# EAGLE design NumPad (EAGLE 6.4)
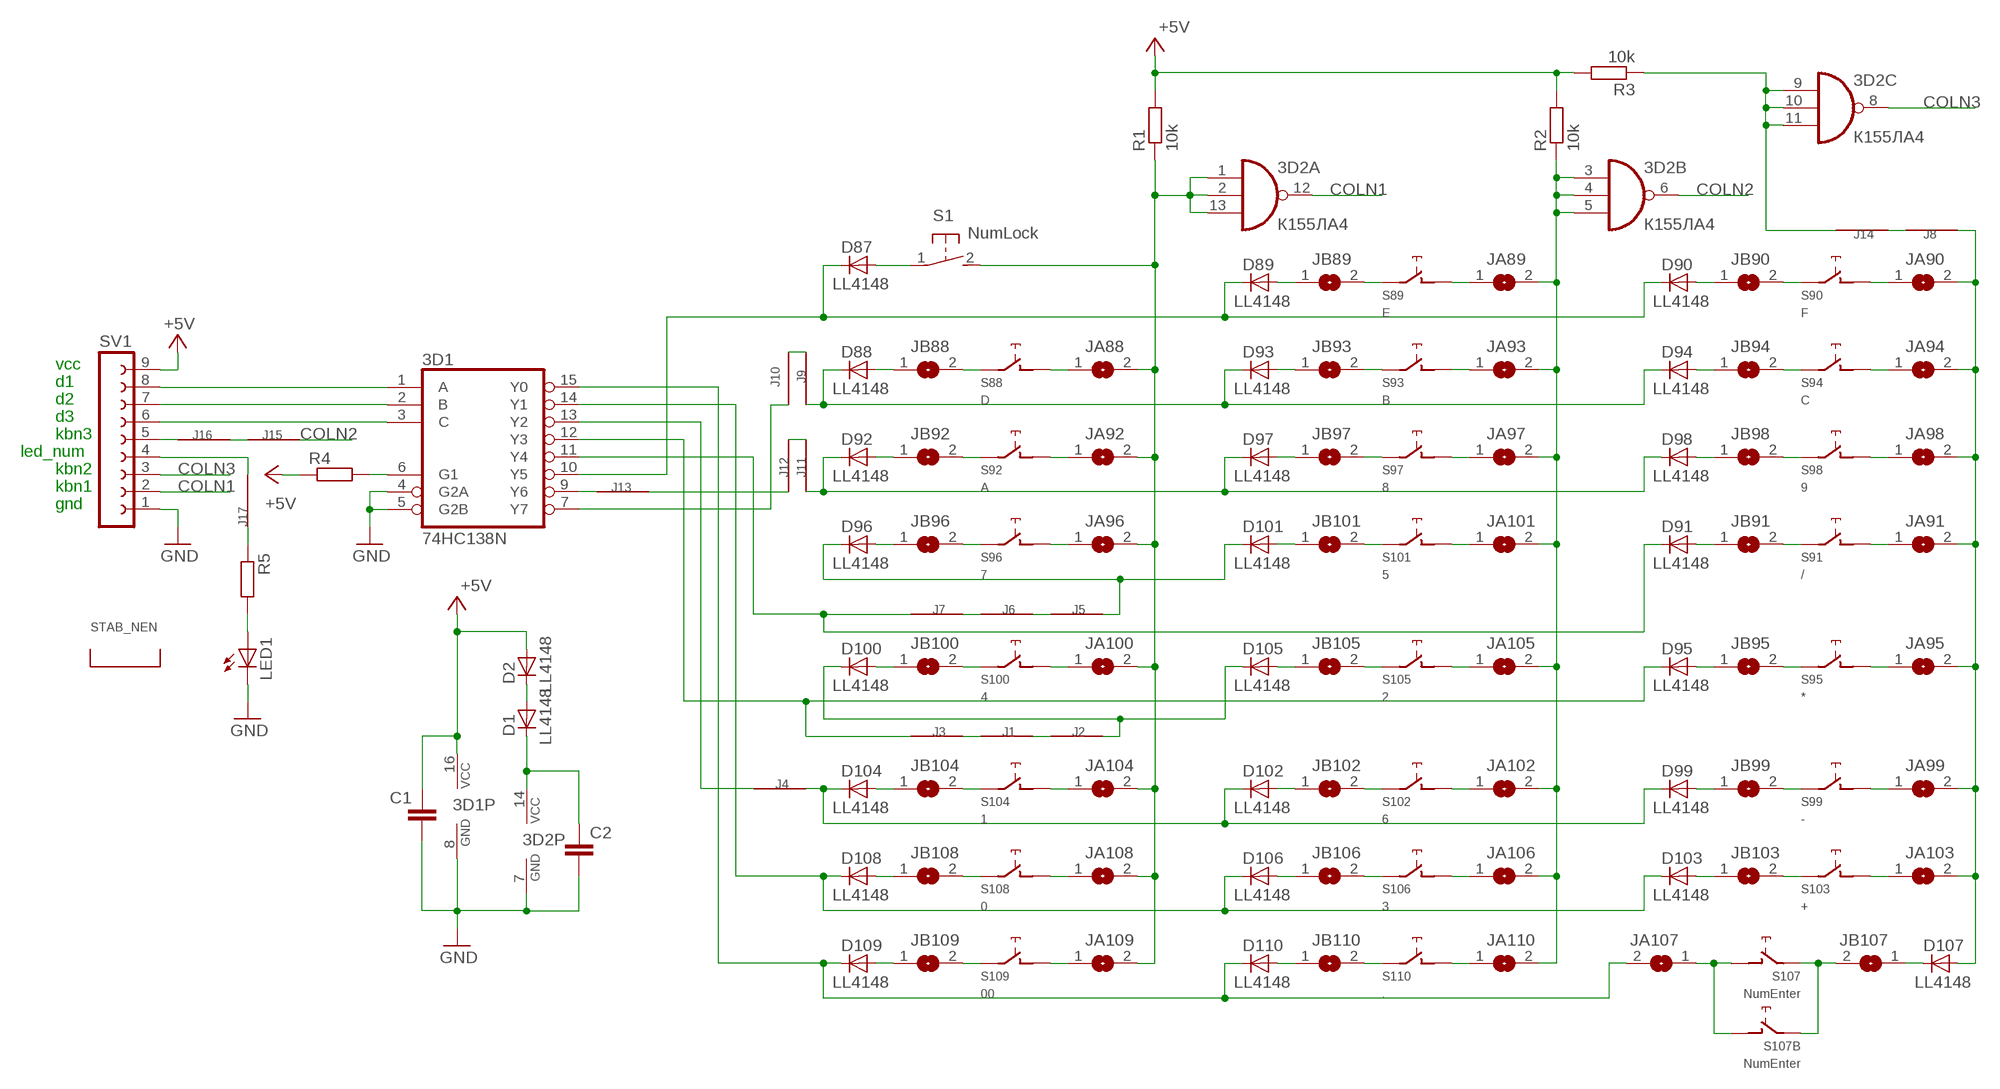
[diagram p0: schematic, sheet 1]

## Parts
3D1  74HC138N  [DIL16]
3D2  К155ЛА4  74HC10N  [DIL14]
C1  C-EUC1206  [C1206]
C2  C-EUC1206  [C1206]
D1  LL4148  [SOD80C]
D2  LL4148  [SOD80C]
D87  LL4148  [SOD80C]
D88  LL4148  [SOD80C]
D89  LL4148  [SOD80C]
D90  LL4148  [SOD80C]
D91  LL4148  [SOD80C]
D92  LL4148  [SOD80C]
D93  LL4148  [SOD80C]
D94  LL4148  [SOD80C]
D95  LL4148  [SOD80C]
D96  LL4148  [SOD80C]
D97  LL4148  [SOD80C]
D98  LL4148  [SOD80C]
D99  LL4148  [SOD80C]
D100  LL4148  [SOD80C]
D101  LL4148  [SOD80C]
D102  LL4148  [SOD80C]
D103  LL4148  [SOD80C]
D104  LL4148  [SOD80C]
D105  LL4148  [SOD80C]
D106  LL4148  [SOD80C]
D107  LL4148  [SOD80C]
D108  LL4148  [SOD80C]
D109  LL4148  [SOD80C]
D110  LL4148  [SOD80C]
J1  J  [R1206W]
J2  J  [R1206W]
J3  J  [R1206W]
J4  J  [R1206W]
J5  J  [R1206W]
J6  J  [R1206W]
J7  J  [R1206W]
J8  J  [R1206W]
J9  J  [R1206W]
J10  J  [R1206W]
J11  J  [R1206W]
J12  J  [R1206W]
J13  J  [R1206W]
J14  J  [R1206W]
J15  J  [R1206W]
J16  J  [R1206W]
J17  J  [R1206W]
JA88  SJ  [SJ]
JA89  SJ  [SJ]
JA90  SJ  [SJ]
JA91  SJ  [SJ]
JA92  SJ  [SJ]
JA93  SJ  [SJ]
JA94  SJ  [SJ]
JA95  SJ  [SJ]
JA96  SJ  [SJ]
JA97  SJ  [SJ]
JA98  SJ  [SJ]
JA99  SJ  [SJ]
JA100  SJ  [SJ]
JA101  SJ  [SJ]
JA102  SJ  [SJ]
JA103  SJ  [SJ]
JA104  SJ  [SJ]
JA105  SJ  [SJ]
JA106  SJ  [SJ]
JA107  SJ  [SJ]
JA108  SJ  [SJ]
JA109  SJ  [SJ]
JA110  SJ  [SJ]
JB88  SJ  [SJ]
JB89  SJ  [SJ]
JB90  SJ  [SJ]
JB91  SJ  [SJ]
JB92  SJ  [SJ]
JB93  SJ  [SJ]
JB94  SJ  [SJ]
JB95  SJ  [SJ]
JB96  SJ  [SJ]
JB97  SJ  [SJ]
JB98  SJ  [SJ]
JB99  SJ  [SJ]
JB100  SJ  [SJ]
JB101  SJ  [SJ]
JB102  SJ  [SJ]
JB103  SJ  [SJ]
JB104  SJ  [SJ]
JB105  SJ  [SJ]
JB106  SJ  [SJ]
JB107  SJ  [SJ]
JB108  SJ  [SJ]
JB109  SJ  [SJ]
JB110  SJ  [SJ]
LED1  LED5MM  [LED5MM]
R1  10k  R-EU_R1206W  [R1206W]
R2  10k  R-EU_R1206W  [R1206W]
R3  10k  R-EU_R1206W  [R1206W]
R4  R-EU_R1206W  [R1206W]
R5  R-EU_R1206W  [R1206W]
S1  NumLock  31-XX  [B3F-31XX]
S88  D  CHERRY-MX-4P  [CHERRY-MX-4P]
S89  E  CHERRY-MX-4P  [CHERRY-MX-4P]
S90  F  CHERRY-MX-4P  [CHERRY-MX-4P]
S91  /  CHERRY-MX-4P  [CHERRY-MX-4P]
S92  A  CHERRY-MX-4P  [CHERRY-MX-4P]
S93  B  CHERRY-MX-4P  [CHERRY-MX-4P]
S94  C  CHERRY-MX-4P  [CHERRY-MX-4P]
S95  *  CHERRY-MX-4P  [CHERRY-MX-4P]
S96  7  CHERRY-MX-4P  [CHERRY-MX-4P]
S97  8  CHERRY-MX-4P  [CHERRY-MX-4P]
S98  9  CHERRY-MX-4P  [CHERRY-MX-4P]
S99  -  CHERRY-MX-4P  [CHERRY-MX-4P]
S100  4  CHERRY-MX-4P  [CHERRY-MX-4P]
S101  5  CHERRY-MX-4P  [CHERRY-MX-4P]
S102  6  CHERRY-MX-4P  [CHERRY-MX-4P]
S103  +  CHERRY-MX-4P  [CHERRY-MX-4P]
S104  1  CHERRY-MX-4P  [CHERRY-MX-4P]
S105  2  CHERRY-MX-4P  [CHERRY-MX-4P]
S106  3  CHERRY-MX-4P  [CHERRY-MX-4P]
S107  NumEnter  CHERRY-MX-4P  [CHERRY-MX-4P]
S107B  NumEnter  CHERRY-MX-4P  [CHERRY-MX-4P]
S108  0  CHERRY-MX-4P  [CHERRY-MX-4P]
S109  00  CHERRY-MX-4P  [CHERRY-MX-4P]
S110  .  CHERRY-MX-4P  [CHERRY-MX-4P]
STAB_NEN  STAB  [ZEALIOS-PCB_2U]
SV1  FE09-1  [FE09]

## Nets
+5V: 3D1.16(VCC) C1.1 D2.A R1.2 R2.2 R3.2 R4.1 SV1.9
COLN1: 3D2.12(A:O) SV1.2
COLN2: 3D2.6(B:O) J15.1
COLN3: 3D2.8(C:O) SV1.3
GND: 3D1.4(G2A) 3D1.5(G2B) 3D1.8(GND) 3D2.7(P:GND) C1.2 C2.2 LED1.K(C) SV1.1
N$1: D92.C D97.C D98.C J11.2
N$2: D100.C D105.C J2.1
N$3: D107.C JB107.1
N$4: J1.2 J3.1
N$5: J1.1 J2.2
N$6: 3D1.1(A) SV1.8
N$7: 3D2.3(B:I0) 3D2.4(B:I1) 3D2.5(B:I2) JA89.2 JA93.2 JA97.2 JA101.2 JA102.2 JA105.2 JA106.2 JA110.2 R2.1
N$8: 3D1.2(B) SV1.7
N$9: D99.C D102.C D104.C J4.1
N$10: 3D1.3(C) SV1.6
N$11: 3D1.13(Y2) J4.2
N$12: D96.C D101.C J5.1
N$13: J6.2 J7.1
N$14: 3D2.1(A:I0) 3D2.2(A:I1) 3D2.13(A:I2) JA88.2 JA92.2 JA96.2 JA100.2 JA104.2 JA108.2 JA109.2 R1.1 S1.2(S)
N$15: J5.2 J6.1
N$16: D88.C D93.C D94.C J9.2
N$17: 3D2.9(C:I0) 3D2.10(C:I1) 3D2.11(C:I2) J14.1 R3.1
N$18: 3D1.7(Y7) J10.1
N$19: J9.1 J10.2
N$20: J11.1 J12.1
N$21: J12.2 J13.1
N$22: D107.A J8.2 JA90.2 JA91.2 JA94.2 JA95.2 JA98.2 JA99.2 JA103.2
N$23: 3D1.9(Y6) J13.2
N$24: 3D1.6(G1) R4.2
N$26: J8.1 J14.2
N$27: LED1.A R5.2
N$28: J16.2 SV1.5
N$29: J15.2 J16.1
N$30: J17.2 SV1.4
N$31: J17.1 R5.1
N$33: 3D1.10(Y5) D87.C D89.C D90.C
N$34: 3D1.11(Y4) D91.C J7.2
N$35: 3D1.12(Y3) D95.C J3.2
N$36: 3D1.14(Y1) D103.C D106.C D108.C
N$38: D1.A D2.C
N$39: 3D2.14(P:VCC) C2.1 D1.C
N$51: JA107.1 S107.SW2(PIN-2) S107B.SW2(PIN-2)
N$60: D104.A JB104.1
N$268: D87.A S1.1(P)
N$269: D88.A JB88.1
N$271: JB88.2 S88.SW1(PIN-1)
N$273: JA88.1 S88.SW2(PIN-2)
N$274: D89.A JB89.1
N$275: JB89.2 S89.SW1(PIN-1)
N$276: JA89.1 S89.SW2(PIN-2)
N$277: D90.A JB90.1
N$278: JB90.2 S90.SW1(PIN-1)
N$279: JA90.1 S90.SW2(PIN-2)
N$280: D91.A JB91.1
N$281: JB91.2 S91.SW1(PIN-1)
N$282: JA91.1 S91.SW2(PIN-2)
N$283: JB92.2 S92.SW1(PIN-1)
N$284: D92.A JB92.1
N$285: JA92.1 S92.SW2(PIN-2)
N$286: JA93.1 S93.SW2(PIN-2)
N$287: JB93.2 S93.SW1(PIN-1)
N$288: D93.A JB93.1
N$289: D94.A JB94.1
N$290: JB94.2 S94.SW1(PIN-1)
N$291: JA94.1 S94.SW2(PIN-2)
N$292: D95.A JB95.1
N$293: JB95.2 S95.SW1(PIN-1)
N$294: JA95.1 S95.SW2(PIN-2)
N$295: D96.A JB96.1
N$296: JB96.2 S96.SW1(PIN-1)
N$297: JA96.1 S96.SW2(PIN-2)
N$298: JB97.2 S97.SW1(PIN-1)
N$299: JA97.1 S97.SW2(PIN-2)
N$300: D97.A JB97.1
N$301: D98.A JB98.1
N$302: JB98.2 S98.SW1(PIN-1)
N$303: JA98.1 S98.SW2(PIN-2)
N$304: D99.A JB99.1
N$305: JB99.2 S99.SW1(PIN-1)
N$306: JA99.1 S99.SW2(PIN-2)
N$307: D100.A JB100.1
N$308: JB100.2 S100.SW1(PIN-1)
N$309: JA100.1 S100.SW2(PIN-2)
N$310: JB101.2 S101.SW1(PIN-1)
N$311: D101.A JB101.1
N$312: JA101.1 S101.SW2(PIN-2)
N$313: D102.A JB102.1
N$314: JB102.2 S102.SW1(PIN-1)
N$315: JA102.1 S102.SW2(PIN-2)
N$316: D103.A JB103.1
N$317: JB103.2 S103.SW1(PIN-1)
N$318: JA103.1 S103.SW2(PIN-2)
N$319: JB107.2 S107.SW1(PIN-1) S107B.SW1(PIN-1)
N$320: JB104.2 S104.SW1(PIN-1)
N$321: JA104.1 S104.SW2(PIN-2)
N$322: JB105.2 S105.SW1(PIN-1)
N$323: D105.A JB105.1
N$324: JA105.1 S105.SW2(PIN-2)
N$325: D106.A JB106.1
N$326: JB106.2 S106.SW1(PIN-1)
N$327: JA106.1 S106.SW2(PIN-2)
N$329: JB108.2 S108.SW1(PIN-1)
N$330: JA108.1 S108.SW2(PIN-2)
N$331: D108.A JB108.1
N$332: JB109.2 S109.SW1(PIN-1)
N$333: D109.A JB109.1
N$334: JA109.1 S109.SW2(PIN-2)
N$335: D110.A JB110.1
N$336: JB110.2 S110.SW1(PIN-1)
N$337: JA110.1 S110.SW2(PIN-2)
SCK: 3D1.15(Y0) D109.C D110.C JA107.2
Unconnected: S88.D1(_D:D1) S88.D2(_D:D2) S88.LED1(_L:LED1) S88.LED2(_L:LED2) S89.D1(_D:D1) S89.D2(_D:D2) S89.LED1(_L:LED1) S89.LED2(_L:LED2) S90.D1(_D:D1) S90.D2(_D:D2) S90.LED1(_L:LED1) S90.LED2(_L:LED2) S91.D1(_D:D1) S91.D2(_D:D2) S91.LED1(_L:LED1) S91.LED2(_L:LED2) S92.D1(_D:D1) S92.D2(_D:D2) S92.LED1(_L:LED1) S92.LED2(_L:LED2) S93.D1(_D:D1) S93.D2(_D:D2) S93.LED1(_L:LED1) S93.LED2(_L:LED2) S94.D1(_D:D1) S94.D2(_D:D2) S94.LED1(_L:LED1) S94.LED2(_L:LED2) S95.D1(_D:D1) S95.D2(_D:D2) S95.LED1(_L:LED1) S95.LED2(_L:LED2) S96.D1(_D:D1) S96.D2(_D:D2) S96.LED1(_L:LED1) S96.LED2(_L:LED2) S97.D1(_D:D1) S97.D2(_D:D2) S97.LED1(_L:LED1) S97.LED2(_L:LED2) S98.D1(_D:D1) S98.D2(_D:D2) S98.LED1(_L:LED1) S98.LED2(_L:LED2) S99.D1(_D:D1) S99.D2(_D:D2) S99.LED1(_L:LED1) S99.LED2(_L:LED2) S100.D1(_D:D1) S100.D2(_D:D2) S100.LED1(_L:LED1) S100.LED2(_L:LED2) S101.D1(_D:D1) S101.D2(_D:D2) S101.LED1(_L:LED1) S101.LED2(_L:LED2) S102.D1(_D:D1) S102.D2(_D:D2) S102.LED1(_L:LED1) S102.LED2(_L:LED2) S103.D1(_D:D1) S103.D2(_D:D2) S103.LED1(_L:LED1) S103.LED2(_L:LED2) S104.D1(_D:D1) S104.D2(_D:D2) S104.LED1(_L:LED1) S104.LED2(_L:LED2) S105.D1(_D:D1) S105.D2(_D:D2) S105.LED1(_L:LED1) S105.LED2(_L:LED2) S106.D1(_D:D1) S106.D2(_D:D2) S106.LED1(_L:LED1) S106.LED2(_L:LED2) S107.D1(_D:D1) S107.D2(_D:D2) S107.LED1(_L:LED1) S107.LED2(_L:LED2) S107B.D1(_D:D1) S107B.D2(_D:D2) S107B.LED1(_L:LED1) S107B.LED2(_L:LED2) S108.D1(_D:D1) S108.D2(_D:D2) S108.LED1(_L:LED1) S108.LED2(_L:LED2) S109.D1(_D:D1) S109.D2(_D:D2) S109.LED1(_L:LED1) S109.LED2(_L:LED2) S110.D1(_D:D1) S110.D2(_D:D2) S110.LED1(_L:LED1) S110.LED2(_L:LED2)

## Notes on the sheet
- vcc
- d1
- d2
- d3
- kbn3
- led_num
- kbn2
- kbn1
- gnd

## Library data of the parts
3D1 = detali:74*138: 3-line to 8-line DECODER/DEMULTIPLEXER
3D2 = detali:74*10: Triple 3-input NAND gate
C1 C2 = rcl:C-EU: CAPACITOR, European symbol
D1 D2 D87-D110 = detali:LL4148: DIODE high speed
J1-J17 = detali:J
JA88-JA110 JB88-JB110 = detali:SJ: SMD solder JUMPER
LED1 = detali:LED: LED OSRAM: - CHIPLED LG R971, LG N971, LY N971, LG Q971, LY Q971, LO R971, LY R971 LH N974, LH R974 LS Q976, LO Q976, LY Q976 LO Q996 - Hyper CHIPLED LW Q18S LB Q993, LB Q99A, LB R99A - SideLED LS A670, LO A670, LY A670, LG A670, LP A670 LB A673, LV A673, LT A673, LW A673 LH A674 LY A675 LS A676, LA A676, LO A676, LY A676, LW A676 LS A679, LY A679, LG A679 - Hyper Micro SIDELED® LS Y876, LA Y876, LO Y876, LY Y876 LT Y87S - SmartLED LW L88C, LW L88S LB L89C, LB L89S, LG L890 LS L89K, LO L89K, LY L89K LS L896, LA L896, LO L896, LY L896 - TOPLED LS T670, LO T670, LY T670, LG T670, LP T670 LSG T670, LSP T670, LSY T670, LOP T670, LYG T670 LG T671, LOG T671, LSG T671 LB T673, LV T673, LT T673, LW T673 LH T674 LS T676, LA T676, LO T676, LY T676, LB T676, LH T676, LSB T676, LW T676 LB T67C, LV T67C, LT T67C, LS T67K, LO T67K, LY T67K, LW E67C LS E67B, LA E67B, LO E67B, LY E67B, LB E67C, LV E67C, LT E67C LW T67C LS T679, LY T679, LG T679 LS T770, LO T770, LY T770, LG T770, LP T770 LB T773, LV T773, LT T773, LW T773 LH T774 LS E675, LA E675, LY E675, LS T675 LS T776, LA T776, LO T776, LY T776, LB T776 LHGB T686 LT T68C, LB T68C - Hyper Mini TOPLED® LB M676 - Mini TOPLED Santana® LG M470 LS M47K, LO M47K, LY M47K Source: http://www.osram.convergy.de LUXEON: - LUMILED® LXK2-PW12-R00, LXK2-PW12-S00, LXK2-PW14-U00, LXK2-PW14-V00 LXK2-PM12-R00, LXK2-PM12-S00, LXK2-PM14-U00 LXK2-PE12-Q00, LXK2-PE12-R00, LXK2-PE12-S00, LXK2-PE14-T00, LXK2-PE14-U00 LXK2-PB12-K00, LXK2-PB12-L00, LXK2-PB12-M00, LXK2-PB14-N00, LXK2-PB14-P00, LXK2-PB14-Q00 LXK2-PR12-L00, LXK2-PR12-M00, LXK2-PR14-Q00, LXK2-PR14-R00 LXK2-PD12-Q00, LXK2-PD12-R00, LXK2-PD12-S00 LXK2-PH12-R00, LXK2-PH12-S00 LXK2-PL12-P00, LXK2-PL12-Q00, LXK2-PL12-R00 Source: www.luxeon.com KINGBRIGHT: KA-3528ASYC Source: www.kingbright.com
R1-R5 = rcl:R-EU_: RESISTOR, European symbol
S1 = detali:31-XX: OMRON SWITCH; MPN: B3F-3100; OC_FARNELL: 959704; OC_NEWARK: 36M3582
S88-S107 S107B S108-S110 = cherrymx:CHERRY-MX-4P
STAB_NEN = kbmxco:STAB
SV1 = detali:FE09-1: FEMALE HEADER; OC_FARNELL: unknown; OC_NEWARK: unknown

## Board
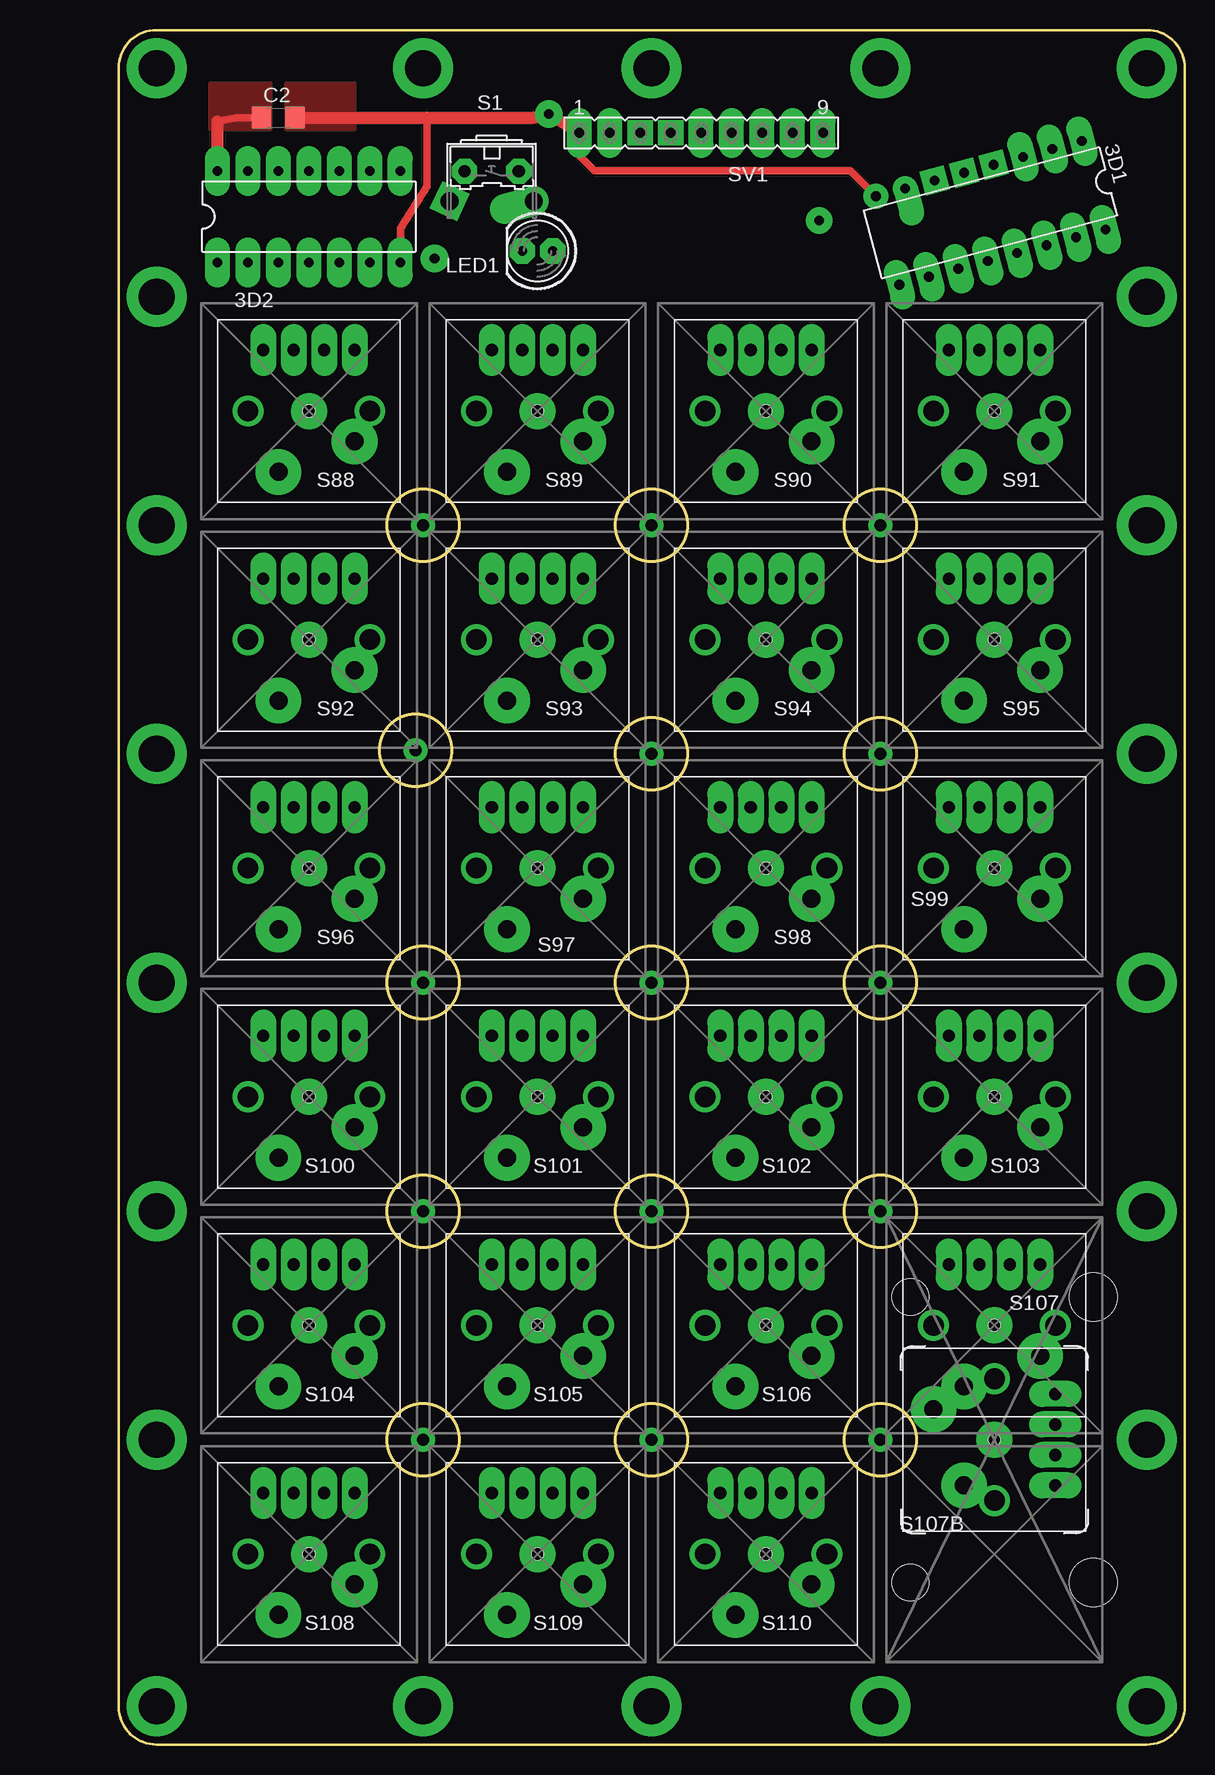
[diagram p1: board, top side]
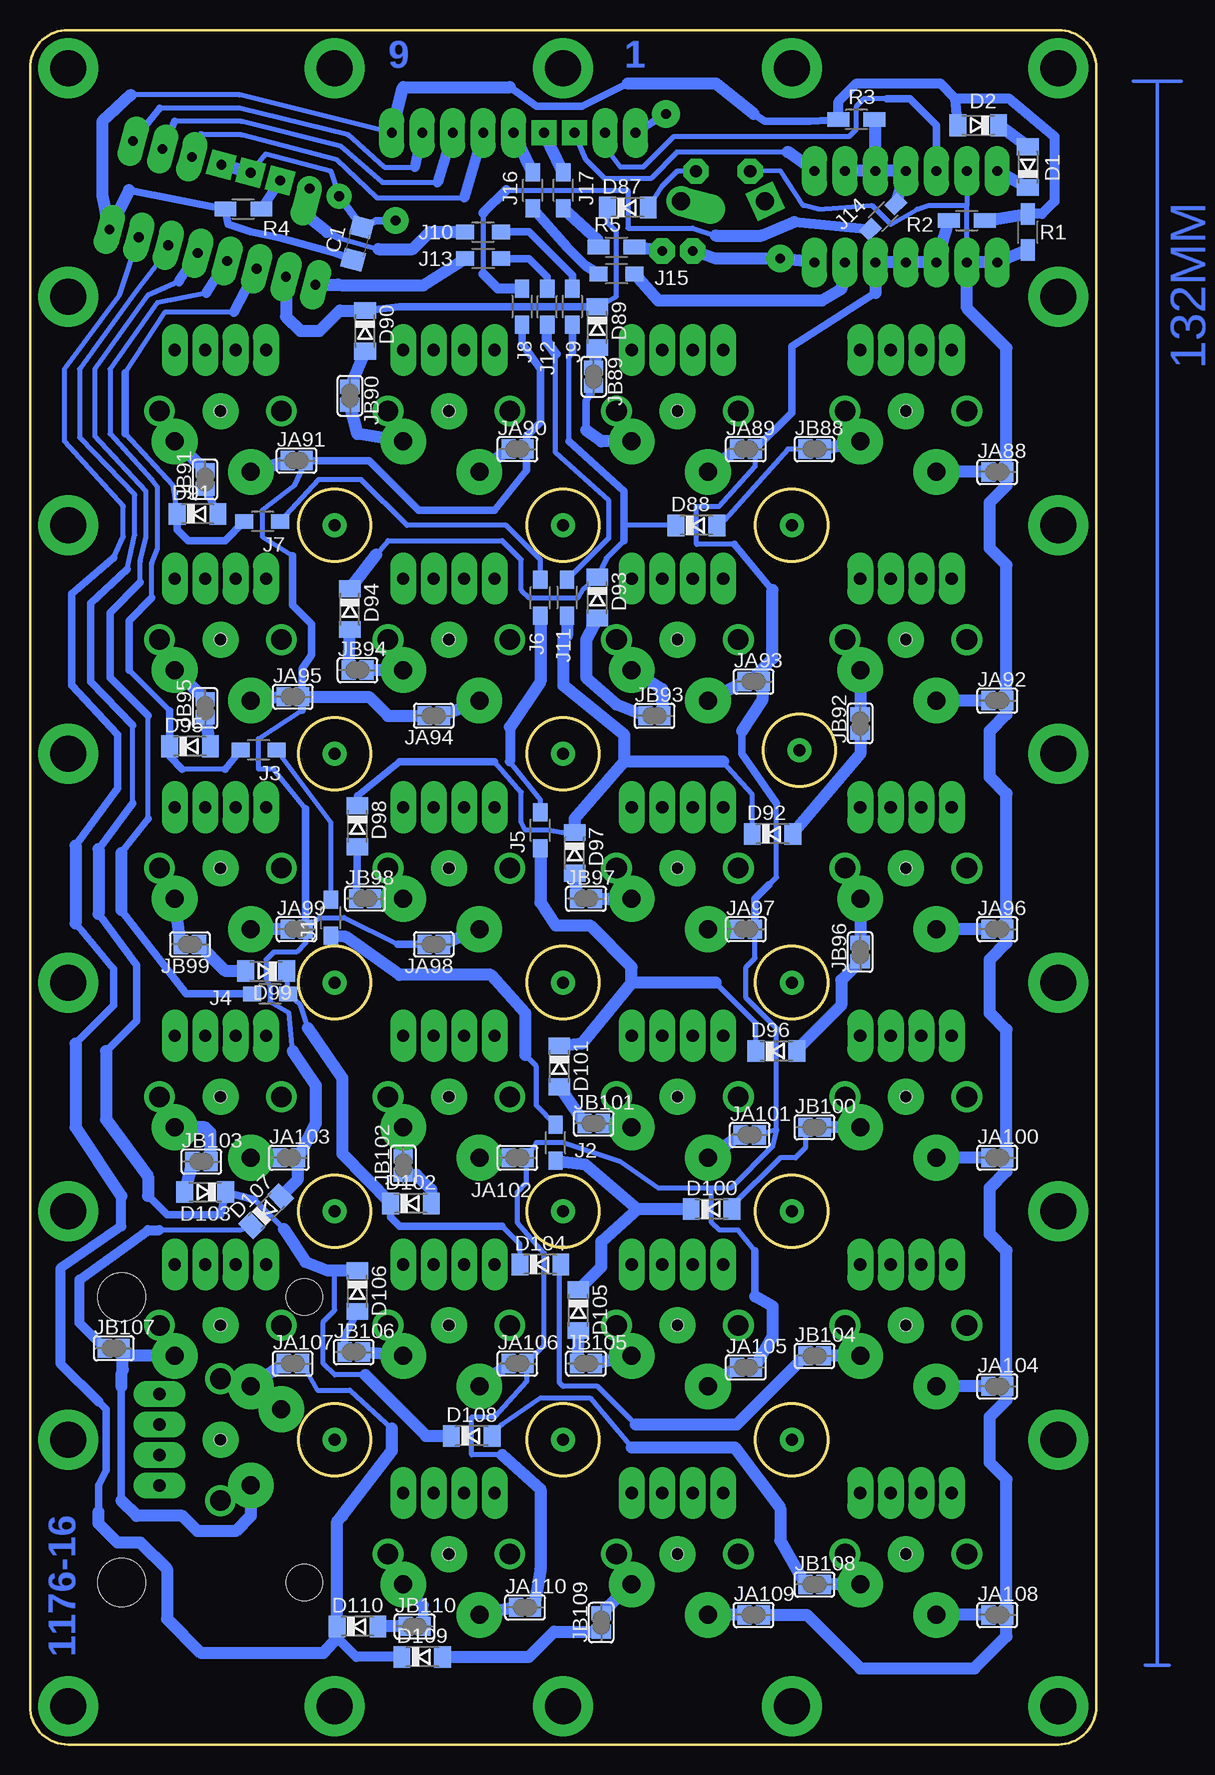
[diagram p2: board, bottom side, seen from below]

Size 88.9 x 142.88 mm. Coordinates in mm from the lower left corner, seen from the top.
Outline: 85.73,142.88 3.18,142.88 arc90 0,139.7 0,3.17 arc90 3.18,0 85.73,0 arc90 88.9,3.17 88.9,139.7 arc90 85.73,142.88
Outline: circle at 63.5,25.4 radius 3
Outline: circle at 63.5,101.6 radius 3
Outline: circle at 25.4,44.45 radius 3
Outline: circle at 44.45,44.45 radius 3
Outline: circle at 44.45,25.4 radius 3
Outline: circle at 25.4,25.4 radius 3
Outline: circle at 25.4,63.5 radius 3
Outline: circle at 24.76,82.87 radius 3
Outline: circle at 63.5,44.45 radius 3
Outline: circle at 63.5,63.5 radius 3
Outline: circle at 63.5,82.55 radius 3
Outline: circle at 44.45,82.55 radius 3
Outline: circle at 44.45,101.6 radius 3
Outline: circle at 25.4,101.6 radius 3
Outline: circle at 44.45,63.5 radius 3
Copper layers (1*16): Top 0.035mm / dielectric 1.5mm / Bottom 0.035mm
Design rules "default": minimum track width 10mil, minimum drill 24mil, track to track 8mil, track to pad 8mil, pad to pad 8mil, via to via 8mil, smd to smd 8mil, copper to edge 40mil, drill to drill 8mil, minimum pad ring 10mil, minimum via ring 8mil, stop-mask expansion 4mil, vias tented up to drill 0mil, thermal gap 10mil

### Footprints (pad centres in the part's own frame; a part is rotated, then mirrored left to right if it is on the bottom)
DIL16 = drill 0.813 pad 2.1 long: 1 -8.89,-3.81; 2 -6.35,-3.81; 3 -3.81,-3.81; 9 8.89,3.81; 10 6.35,3.81; 11 3.81,3.81; 12 1.27,3.81; 13 -1.27,3.81; 14 -3.81,3.81; 15 -6.35,3.81; 16 -8.89,3.81 | drill 0.813 pad 2.1 square: 4 -1.27,-3.81; 5 1.27,-3.81; 6 3.81,-3.81 | drill 0.813 pad 2.1 offset: 7 6.35,-3.81 | drill 0.813 pad 2.1: 8 8.89,-3.81
DIL14 = drill 0.813 pad 2.1 long: 1 -7.62,-3.81; 2 -5.08,-3.81; 3 -2.54,-3.81; 4 0,-3.81; 5 2.54,-3.81; 6 5.08,-3.81; 7 7.62,-3.81; 8 7.62,3.81; 9 5.08,3.81; 10 2.54,3.81; 11 0,3.81; 12 -2.54,3.81; 13 -5.08,3.81; 14 -7.62,3.81
C1206 = smd 1.6 x 1.8: 1 -1.4,0; 2 1.4,0
SOD80C = smd 1.4 x 1.8 bottom: A -1.7,0; C 1.7,0
R1206W = smd 1.5 x 1.2: 1 -1.499,0; 2 1.499,0
SJ = smd 1.168 x 1.6 bottom: 1 0.762,0; 2 -0.762,0
LED5MM = drill 0.813 pad 2.1 octagon: A -1.27,0; K 1.27,0
R1206W' = smd 1.8 x 1.2: 1 -1.499,0; 2 1.499,0
B3F-31XX = drill 1.016 pad 2.1 octagon: 1 -2.261,-1.245; 2 2.261,-1.245 | drill 1.499 pad 2.5 offset: 3 -3.505,1.245 | drill 1.499 pad 2.5 square: 4 3.505,1.245
CHERRY-MX-4P = drill 1.016 pad 2.184 long: D1 -3.81,-5.08; D2 3.81,-5.08; LED1 -1.27,-5.08; LED2 1.27,-5.08 | drill 1 pad 3: P$1 0,0 | drill 1.714 pad 1.93: P$3 -5.08,0; P$4 5.08,0 | drill 1.5 pad 3.81: SW1 -3.81,2.54; SW2 2.54,5.08 | hole 1: 0,0
ZEALIOS-PCB_2U = drill 0.9 pad 3: P$1 -11.906,6.985; P$2 11.906,6.985 | drill 0.9 pad 4: P$3 11.906,-8.255; P$4 -11.906,-8.255 | hole 3.05: -11.9,7; 11.9,7 | hole 4: 11.9,-8.24; -11.9,-8.24
FE09 = drill 0.813 pad 2.1 long: 1 -10.16,0; 2 -7.62,0; 5 0,0; 6 2.54,0; 7 5.08,0; 8 7.62,0; 9 10.16,0 | drill 0.813 pad 2.1 square: 3 -5.08,0; 4 -2.54,0

### Placement (x,y rotation side)
3D1  72.71,127.63 195 top
3D2  15.87,127.32 0 top
C1  61.59,125.09 75 bottom
C2  13.34,135.57 0 top
D1  5.71,131.44 270 top
D2  9.84,134.94 180 top
D87  39.07,128.08 0 top
D88  33.34,101.6 0 top
D89  41.59,118.11 90 top
D90  60.96,117.79 90 top
D91  74.93,102.55 0 top
D92  26.99,75.88 0 top
D93  41.59,95.57 90 top
D94  62.23,94.61 90 top
D95  75.56,83.19 0 top
D96  26.67,57.78 0 top
D97  43.5,74.3 90 top
D98  61.59,76.52 90 top
D99  69.22,64.45 180 top
D100  32.07,44.61 0 top
D101  44.77,56.52 90 top
D102  57.15,45.09 0 top
D103  74.3,46.04 180 top
D104  46.36,40.01 0 top
D105  43.18,36.2 90 top
D106  61.59,37.78 90 top
D107  69.22,44.45 315 top
D108  52.07,25.72 0 top
D109  56.2,7.3 0 top
D110  61.59,9.84 0 top
J1  63.82,68.9 90 bottom
J2  45.08,50.17 90 bottom
J3  69.85,82.87 180 bottom
J4  68.9,62.55 180 bottom
J5  46.36,76.2 90 bottom
J6  46.36,95.57 90 bottom
J7  69.53,101.92 180 bottom
J8  47.88,119.82 270 bottom
J9  43.69,119.82 270 bottom
J10  51.12,126.05 0 bottom
J11  44.13,95.57 270 bottom
J12  45.78,119.82 90 bottom
J13  51.12,123.82 180 bottom
J14  17.78,127.32 225 bottom
J15  40,122.56 180 bottom
J16  46.99,129.54 90 bottom
J17  44.45,129.54 90 bottom
JA88  8.25,106.05 0 top
JA89  29.21,107.95 0 top
JA90  48.26,107.95 0 top
JA91  66.67,107 0 top
JA92  8.25,87 0 top
JA93  28.57,88.58 0 top
JA94  55.25,85.72 180 top
JA95  66.99,87.31 0 top
JA96  8.25,67.95 0 top
JA97  29.21,67.95 0 top
JA98  55.25,66.67 180 top
JA99  66.67,67.95 0 top
JA100  8.25,48.9 0 top
JA101  28.89,50.8 0 top
JA102  48.26,48.9 0 top
JA103  67.31,48.9 0 top
JA104  8.25,29.84 0 top
JA105  29.21,31.43 0 top
JA106  48.26,31.75 0 top
JA107  66.99,31.75 0 top
JA108  8.25,10.79 0 top
JA109  28.57,10.79 0 top
JA110  47.62,11.43 0 top
JB88  23.5,107.95 0 top
JB89  41.91,113.98 90 top
JB90  62.23,112.39 90 top
JB91  74.3,105.41 270 top
JB92  19.68,85.09 270 top
JB93  36.83,85.72 0 top
JB94  61.59,89.53 0 top
JB95  74.3,86.36 270 top
JB96  19.68,66.04 270 top
JB97  42.55,70.48 0 top
JB98  60.96,70.48 0 top
JB99  75.56,66.67 180 top
JB100  23.5,51.44 0 top
JB101  41.91,51.75 0 top
JB102  57.78,48.26 270 top
JB103  74.61,48.58 0 top
JB104  23.5,32.38 0 top
JB105  42.55,31.75 0 top
JB106  61.91,32.7 0 top
JB107  81.92,33.02 0 top
JB108  23.5,13.33 0 top
JB109  41.28,10.16 270 top
JB110  56.83,9.84 0 top
LED1  34.92,124.46 180 top
R1  10k  [R1206W']  5.71,126.05 90 bottom
R2  10k  [R1206W']  10.79,127 0 bottom
R3  10k  [R1206W']  20,135.41 180 bottom
R4  [R1206W']  71.12,127.95 0 bottom
R5  [R1206W']  40,124.78 0 bottom
S1  31.11,129.86 180 top
S88  15.87,111.12 180 top
S89  34.92,111.12 180 top
S90  53.98,111.12 180 top
S91  73.03,111.12 180 top
S92  15.87,92.08 180 top
S93  34.92,92.08 180 top
S94  53.98,92.08 180 top
S95  73.03,92.08 180 top
S96  15.87,73.03 180 top
S97  34.92,73.03 180 top
S98  53.98,73.03 180 top
S99  73.03,73.03 180 top
S100  15.87,53.97 180 top
S101  34.92,53.97 180 top
S102  53.98,53.97 180 top
S103  73.03,53.97 180 top
S104  15.87,34.93 180 top
S105  34.92,34.93 180 top
S106  53.98,34.93 180 top
S107  73.03,34.93 180 top
S107B  73.03,25.4 90 top
S108  15.87,15.87 180 top
S109  34.92,15.87 180 top
S110  53.98,15.87 180 top
STAB_NEN  73.03,25.4 90 top
SV1  48.58,134.3 0 top
U$1  [18X18]  71.76,17.14 0 top
U$2  [NUMENTER]  75.56,25.4 0 top
U$3  [KEY]  56.52,34.93 0 top
U$4  [KEY]  56.52,15.87 0 top
U$5  [KEY]  37.47,34.93 0 top
U$6  [KEY]  37.47,15.87 0 top
U$7  [KEY]  18.42,15.87 0 top
U$8  [KEY]  18.42,34.93 0 top
U$9  [KEY]  56.52,53.97 0 top
U$10  [KEY]  37.47,53.97 0 top
U$11  [KEY]  18.42,53.97 0 top
U$12  [KEY]  75.56,53.97 0 top
U$13  [KEY]  75.56,73.03 0 top
U$14  [KEY]  56.52,73.03 0 top
U$15  [KEY]  37.47,73.03 0 top
U$16  [KEY]  18.42,73.03 0 top
U$17  [KEY]  18.42,92.08 0 top
U$18  [KEY]  37.47,92.08 0 top
U$19  [KEY]  56.52,92.08 0 top
U$20  [KEY]  75.56,92.08 0 top
U$21  [KEY]  75.56,111.12 0 top
U$22  [KEY]  56.52,111.12 0 top
U$23  [KEY]  37.47,111.12 0 top
U$24  [KEY]  18.42,111.12 0 top
U$26  [SIZE132]  -5.08,74.61 0 top  (outside the outline)
U$88  [18X18]  14.61,112.39 0 top
U$89  [18X18]  33.66,112.39 0 top
U$90  [18X18]  52.7,112.39 0 top
U$91  [18X18]  71.76,112.39 0 top
U$92  [18X18]  71.76,93.34 0 top
U$93  [18X18]  52.7,93.34 0 top
U$94  [18X18]  33.66,93.34 0 top
U$95  [18X18]  14.61,93.34 0 top
U$96  [18X18]  14.61,74.3 0 top
U$97  [18X18]  33.66,74.3 0 top
U$98  [18X18]  52.7,74.3 0 top
U$99  [18X18]  71.76,74.3 0 top
U$100  [18X18]  14.61,55.25 0 top
U$101  [18X18]  33.66,55.25 0 top
U$102  [18X18]  52.7,55.25 0 top
U$103  [18X18]  71.76,55.25 0 top
U$104  [18X18]  14.61,36.2 0 top
U$105  [18X18]  33.66,36.2 0 top
U$106  [18X18]  52.7,36.2 0 top
U$107  [18X18]  71.76,36.2 0 top
U$108  [18X18]  14.61,17.14 0 top
U$109  [18X18]  33.66,17.14 0 top
U$110  [18X18]  52.7,17.14 0 top
U$111  [37X18]  73.03,25.4 0 top

### Tracks (layer width: path | path; a pad name or v marks a point on that pad's centre or on a via)
+5V
  Bottom 0.406: SV1.9 71.44,137.48 80.49,137.48
  Bottom 0.61: C1.1 63.53,124.33 68.1,125.57 70.48,126.05 72.39,126.68 R4.1 80.65,129.54 | 28.57,135.89 27.62,135.25 23.88,135.25 R3.2 | 39.05,138.43 42.86,136.53 46.67,136.53 48.9,138.11
  Bottom 0.813: R3.2 21.5,136.93 20,138.43 13.02,138.43 11.75,137.16 | R1.2 4.53,127.55 3.49,128.59 3.49,133.99 7.3,137.16 11.75,137.16 | D2.A 11.75,137.16
  Bottom 1.016: SV1.9 57.78,138.11 48.9,138.11 | 39.05,138.43 31.75,138.43 28.57,135.89 | 80.65,129.54 3D1.16 82.87,129.06 82.87,135.25 80.49,137.48 | R2.2 R1.2
COLN1
  Bottom 0.406: SV1.2 40.64,132.72 39.69,131.44 37.78,131.44 35.24,133.99 20.64,133.99 20,134.62 20,136.53 19.37,137.16 17.46,137.16
  Bottom 0.61: 3D2.12 13.34,134.94 15.56,137.16 17.46,137.16
COLN2
  Bottom 1.016: 3D2.6 21.27,121.28 22.86,120.33 36.51,120.33 J15.1
COLN3
  Bottom 0.406: SV1.3 42.54,132.08 40.96,130.49 37.15,130.49 34.93,132.72 25.72,132.72
  Bottom 1.016: 3D2.8 25.72,132.72
GND  (via drill 0.8 pad 2.2, 0.8 pad 2.3)
  Top 0.61: SV1.1 38.42,132.4 39.69,131.13 61.02,131.13 3D1.8 | 25.72,135.57 25.72,129.86 23.5,126.37 3D2.7
  Top 1.016: SV1.1 v35.88,135.89 34.61,135.57 25.72,135.57 C2.2
  Bottom 0.406: 3D1.5 69.21,132.56 63.82,131.13 3D1.8
  Bottom 0.61: v58.42,127 60.04,127 C1.2 3D1.8 | v35.88,135.89 SV1.1
  Bottom 1.016: 3D1.5 3D1.4 | 3D2.7 v26.35,123.82 31.75,123.82 LED1.K
  pour Top (no thermals): 13.97,134.62 19.68,134.62 19.68,138.43 13.97,138.43
N$1
  Bottom 0.406: D92.C 28.69,79.17 31.11,81.92 | D97.C 44.56,76 45.72,76.2 47.62,76.2 47.94,76.84 47.94,79.38 50.17,81.92
  Bottom 0.61: D98.C 61.59,79.06 58.1,81.92 50.17,81.92
  Bottom 1.016: J11.2 44.13,92.39 44.45,92.08 44.45,88.27 39.37,84.14 39.37,81.92 | 39.37,81.92 43.5,77.15 D97.C | 31.11,81.92 39.37,81.92
N$2
  Bottom 1.016: D105.C 41.28,39.8 41.28,41.91 38.26,44.61 | J2.1 42.63,48.35 38.26,44.61 | D100.C 38.26,44.61
N$3
  Bottom 0.406: 78.11,42.86 71.44,42.86 D107.C
  Bottom 0.813: JB107.1 84.77,35.12 84.77,38.73 80.33,41.91 79.06,42.86 78.11,42.86
N$4
  Bottom 0.406: J3.1 63.82,76.84 J1.2
N$5
  Bottom 0.406: J2.2 46.67,53.25 46.67,56.52 47.62,57.47
  Bottom 1.016: 47.62,57.47 47.62,60.96 50.48,64.14 58.1,64.14 62.55,67.31 J1.1
N$6
  Bottom 0.406: 78.11,136.37 71.44,136.37 62.39,134.14 59.37,131.44 56.83,131.44
  Bottom 0.61: 78.11,136.37 3D1.1
  Bottom 0.813: SV1.8 56.83,131.44
N$7
  Bottom 0.406: 26.67,51.25 26.99,49.85 30.48,46.36 32.07,46.36 | 32.07,46.36 36.51,46.36 39.69,48.58 44.45,50.17 46.67,50.17 JA102.2 47.5,46.8 48.26,46.04 48.26,43.5 46.04,40.96 46.04,33.21 JA106.2 47.5,30.29 50.17,27.3 52.07,27.3 52.07,24.13 49.53,24.13 | 32.07,46.36 32.07,43.5 31.43,42.86 29.85,42.86 28.45,41.15 | 26.67,51.25 JA101.2 | 30.16,100.01 33.34,100.01 33.34,103.19 31.43,103.19 28.45,106.49 JA89.2 | 26.67,51.25 26.67,59.69 29.21,62.23 29.21,64.77 28.45,65.53 JA97.2 | 27.31,71.63 26.67,72.26 26.67,78.42
  Bottom 0.61: JA97.2 28.45,70.48 27.31,71.63 | 28.45,37.34 28.45,41.15 | JA89.2 25.4,111 25.4,116.52 18.42,120.97 | 30.16,100.01 26.99,96.2 | 29.53,84.45 29.53,82.55 26.67,78.42
  Bottom 1.016: 28.45,37.34 26.99,36.51 26.99,33.97 JA105.2 | 49.53,24.13 46.36,21.27 46.36,14.6 JA110.2 | R2.1 3D2.3 3D2.4 3D2.5 18.42,120.97 | 26.99,96.2 26.99,90.49 28.26,89.22 JA93.2 27.81,87.12 29.53,84.45
N$8
  Bottom 0.406: 76.84,135.25 71.28,135.25 63.02,133.19 59.53,130.18 54.93,130.18
  Bottom 0.61: 76.84,135.25 3D1.2
  Bottom 0.813: SV1.7 54.93,130.18
N$9
  Bottom 0.406: D104.C 48.06,41.7 49.53,43.18 | 65.72,59.69 66.36,61.59 J4.1 D99.C
  Bottom 0.61: 49.53,43.18 58.1,43.18 58.85,43.93 D102.C
  Bottom 1.016: D102.C 62.87,49.21 62.87,55.56 65.72,59.69
N$10
  Bottom 0.406: 52.7,128.91 60.01,128.91 63.34,132.08 71.28,134.14 74.61,134.14
  Bottom 0.61: 74.61,134.14 3D1.3
  Bottom 0.813: SV1.6 52.7,128.91
N$11
  Bottom 0.406: 76.5,121.92 79.06,120.81 83.5,114.62 83.5,109.06 79.22,104.46 79.22,100.65 79.69,98.58 79.69,96.84 | 79.06,77.15 79.06,85.72
  Bottom 0.61: J4.2 75.88,62.55 81.28,69.53 | 79.06,77.15 81.28,74.3 | 79.69,96.84 82.23,94.3 82.23,88.9 79.06,85.72
  Bottom 0.813: 76.5,121.92 3D1.13
  Bottom 1.016: 81.28,74.3 81.28,69.53
N$12
  Bottom 0.406: D96.C 28.37,60.12 31.75,63.5
  Bottom 1.016: J5.1 46.36,70.17 45.08,68.26 42.23,68.26 38.74,64.77 38.74,63.5 | D101.C 42.86,58.42 38.74,63.5 | 31.75,63.5 38.74,63.5
N$13
  Bottom 0.406: J6.2 46.36,98.74 49.21,101.6 57.47,101.6 61.28,105.41 64.86,105.41 J7.1
N$14
  Bottom 0.406: 3D2.13 10.79,128.27 | 10.79,128.27 13.97,128.27 14.92,127.95 17.14,126.68 18.73,128.27 23.18,127.95 24.45,128.27 26.35,131.13 S1.2 | 3D2.2 10.79,128.27
  Bottom 0.813: JA104.2 7.49,30.48
  Bottom 1.016: JA109.2 24.13,10.79 19.68,6.35 10.16,6.35 7.49,9.02 JA108.2 7.49,22.1 8.89,23.5 8.89,27.3 7.49,28.7 JA104.2 | 7.49,30.48 7.49,41.15 8.89,42.55 8.89,46.36 7.49,47.75 JA100.2 7.49,59.56 8.89,60.96 8.89,65.41 7.49,66.8 JA96.2 7.49,79.25 8.89,80.64 8.89,84.45 7.49,85.85 JA92.2 7.49,98.3 8.89,99.7 8.89,103.5 7.49,104.9 JA88.2 7.49,116.4 10.79,119.7 3D2.2 3D2.1 R1.1
N$15
  Bottom 0.406: J5.2 46.36,78.74 48.9,81.92
  Bottom 0.813: 48.9,84.77 48.9,81.92
  Bottom 1.016: J6.1 46.36,88.58 48.9,84.77
N$16
  Bottom 0.406: 60.01,99.17 59.06,100.33 49.53,100.33 47.94,98.74 47.94,96.2 47.31,95.57 43.18,95.57 42.75,96.31 D93.C 40.85,98.86 39.37,100.33 | D88.C 39.37,101.6 | 43.97,108.59 43.97,115.57 43.69,116.01
  Bottom 0.61: 43.69,116.01 J9.2 | 43.97,108.59 39.37,104.46 39.37,101.6 39.37,100.33
  Bottom 1.016: D94.C 60.01,99.17
N$17
  Bottom 1.016: J14.1 3D2.11 3D2.10 | 3D2.10 3D2.9 | 3D2.10 18.42,135.32 R3.1
N$18
  Bottom 0.406: 63.18,125.57 59.85,124.62
  Bottom 0.61: 64.14,126.05 63.18,125.57
  Bottom 1.016: 59.85,124.62 56.99,124.62 55.56,126.05 J10.1 | 64.14,126.05 65.72,127.32 3D1.7
N$19
  Bottom 0.61: J9.1 43.69,122.43 47.31,126.05 J10.2
N$20
  Bottom 0.406: J11.1 40.64,100.56 40.64,103.66 45.08,107.63 45.08,115.89
  Bottom 0.813: 45.08,115.89 45.78,116.9 J12.1
N$21
  Bottom 0.61: J12.2 45.78,122.3 47.31,123.82 J13.1
N$22
  Bottom 0.406: 66.99,57.78 67.31,60.96 68.9,61.91 68.9,63.18 69.21,63.82 69.21,65.41 68.58,66.04 66.67,66.04 65.91,66.8 JA99.2 64.77,68.9 62.71,68.9 58.26,66.67 | 65.91,77.98 68.58,81.28 69.85,81.28 69.85,83.82 66.23,86.17 | JA91.2 66.87,104.9 69.53,102.87 69.53,100.65 66.99,99.06
  Bottom 0.61: 66.23,86.17 JA95.2 66.23,89.66 65.4,90.81 65.4,93.34 66.99,94.93 66.99,99.06 | JA99.2 65.91,77.98 | JA91.2 60.64,107 56.51,102.87 50.17,102.87 47.5,106.17 JA90.2 47.5,109.03 46.36,110.17 46.36,114.62 47.88,116.78 J8.2 | JA98.2 58.26,66.67
  Bottom 1.016: JA95.2 60.64,87.31 59.06,85.72 JA94.2 | D107.A 66.55,47.12 JA103.2 65.09,51.75 65.09,54.93 66.99,57.78
N$23
  Bottom 0.406: 52.39,123.82 J13.2
  Bottom 1.016: 3D1.9 63.23,121.65 62.87,121.6 56.11,121.6 J13.2
N$24
  Bottom 0.813: 3D1.6 R4.2
N$25  (via drill 3 pad 5)
  other vias: 3.18,3.17
N$26
  Bottom 0.406: 49.21,129.54 39.05,129.54 39.05,126.37 33.65,126.37 31.75,125.73 | 51.12,127.63 51.12,122.56
  Bottom 0.813: 25.19,126.89 J14.2 | 49.21,129.54 51.12,127.63 | J8.1 49.89,121.32 51.12,122.56
  Bottom 1.016: 31.75,125.73 27.94,125.73 25.19,126.89
N$27
  Bottom 1.016: LED1.A R5.2
N$28
  Bottom 1.016: J16.2 SV1.5
N$29
  Bottom 0.813: J15.2 42.54,123.19 44.13,124.78 J16.1
N$30
  Bottom 1.016: J17.2 SV1.4
N$31
  Bottom 1.016: J17.1 41.59,125.41 R5.1
N$32  (via drill 3 pad 5)
  other vias: 85.73,3.17
N$33
  Bottom 0.406: D89.C 40,120.65 40,126.05 40.77,126.81 D87.C
  Bottom 0.61: 43.8,119.82 D89.C 58.1,119.81 D90.C
  Bottom 1.016: 3D1.10 67.56,119 66.36,117.79 64.77,117.79 63.07,119.49 D90.C
N$34
  Bottom 0.406: 80.96,114.3 77.63,119.38 71.9,119.38 | 80.96,109.22 76.99,104.93 D91.C
  Bottom 0.61: 80.96,109.22 80.96,114.3 | J7.2 72.62,100.33 75.72,100.33 76.63,101.24 D91.C
  Bottom 0.813: 71.9,119.38 3D1.11
N$35
  Bottom 0.406: 72.62,81.28 76.2,81.28 | 74.2,120.97 78.26,120.17 82.23,114.62 82.23,109.22 78.74,105.41 78.26,104.78 78.26,99.7 78.74,98.42 78.74,95.57 | 77.26,86.16 80.65,89.53
  Bottom 0.61: 76.2,81.28 77.26,82.34 D95.C 77.26,86.16 | 80.65,89.53 80.65,93.66 78.74,95.57 | J3.2 72.62,81.28
  Bottom 0.813: 74.2,120.97 3D1.12
N$36
  Bottom 0.406: 60.96,30.8 63.5,30.8 64.45,31.75 64.45,35.24 63.5,36.2 63.5,39.48 | 67.72,42.95 70.17,45.4 | 3D1.14 78.17,123.51 80.01,121.13 84.77,114.62 84.77,108.9 80.17,104.14 80.17,100.81 80.8,97.95 | 80.33,78.42 80.33,84.93
  Bottom 0.61: 83.18,69.22 80.01,64.93 80.01,60.33 82.55,57.78 | 79.06,45.72 77.47,44.13 73.03,44.13 D103.C 70.17,45.4 | 80.33,78.42 83.18,74.61 | 80.8,97.95 83.82,95.09 83.82,88.58 80.33,84.93
  Bottom 1.016: 60.96,30.8 55.88,25.72 D108.C | 67.72,42.95 65.93,40.21 64.02,39.48 63.5,39.48 D106.C | 82.55,57.78 82.55,52.07 79.06,47.31 79.06,45.72 | 83.18,74.61 83.18,69.22
N$37  (via drill 3 pad 5)
  other vias: 3.18,139.7
N$38
  Bottom 1.016: D1.A D2.C
N$39
  Top 0.61: C2.1 9.84,135.57 8.25,135.25
  Top 1.016: 3D2.14 8.25,135.25
  Bottom 1.016: D1.C 3D2.14
  pour Top (no thermals): 7.62,134.62 12.7,134.62 12.7,138.43 7.62,138.43
N$40  (via drill 3 pad 5)
  other vias: 85.73,139.7
N$41  (via drill 3 pad 5)
  other vias: 63.5,3.17
N$42  (via drill 3 pad 5)
  other vias: 85.73,101.6
N$43  (via drill 3 pad 5)
  other vias: 63.5,139.7
N$44  (via drill 3 pad 5)
  other vias: 3.18,44.45
N$45  (via drill 3 pad 5)
  other vias: 85.73,25.4
N$46  (via drill 3 pad 5)
  other vias: 85.73,63.5
N$47  (via drill 3 pad 5)
  other vias: 85.73,120.65
N$48  (via drill 3 pad 5)
  other vias: 3.18,120.65
N$49  (via drill 3 pad 5)
  other vias: 44.45,3.17
N$50  (via drill 3 pad 5)
  other vias: 25.4,3.17
N$51
  Bottom 1.016: S107B.SW2 S107.SW2 JA107.1
N$52  (via drill 3 pad 5)
  other vias: 85.73,44.45
N$53  (via drill 3 pad 5)
  other vias: 85.73,82.55
N$54  (via drill 3 pad 5)
  other vias: 3.18,101.6
N$55  (via drill 3 pad 5)
  other vias: 3.18,82.55
N$56  (via drill 3 pad 5)
  other vias: 3.18,63.5
N$57  (via drill 3 pad 5)
  other vias: 3.18,25.4
N$58  (via drill 3 pad 5)
  other vias: 25.4,139.7
N$59  (via drill 3 pad 5)
  other vias: 44.45,139.7
N$60
  Bottom 0.406: 38.42,26.67 41.59,29.84 44.45,29.84 44.77,30.16 44.77,39.89 D104.A
  Bottom 1.016: 38.42,26.67 29.97,26.67 JB104.1
N$61  (via drill 1 pad 2)
  other vias: 25.4,25.4
N$62  (via drill 1 pad 2)
  other vias: 44.45,25.4
N$63  (via drill 1 pad 2)
  other vias: 63.5,25.4
N$64  (via drill 1 pad 2)
  other vias: 63.5,44.45
N$65  (via drill 1 pad 2)
  other vias: 44.45,44.45
N$66  (via drill 1 pad 2)
  other vias: 25.4,44.45
N$67  (via drill 1 pad 2)
  other vias: 25.4,63.5
N$68  (via drill 1 pad 2)
  other vias: 44.45,63.5
N$69  (via drill 1 pad 2)
  other vias: 63.5,63.5
N$70  (via drill 1 pad 2)
  other vias: 63.5,82.55
N$71  (via drill 1 pad 2)
  other vias: 44.45,82.55
N$72  (via drill 1 pad 2)
  other vias: 24.76,82.87
N$73  (via drill 1 pad 2)
  other vias: 25.4,101.6
N$74  (via drill 1 pad 2)
  other vias: 44.45,101.6
N$75  (via drill 1 pad 2)
  other vias: 63.5,101.6
N$268
  Bottom 0.406: D87.A 36.19,129.86 34.93,131.13 34.9,131.1 S1.1
N$269
  Bottom 0.406: JB88.1 25.72,107.95 31,102.03 D88.A
N$271
  Bottom 1.016: S88.SW1 JB88.2
N$273
  Bottom 1.016: JA88.1 S88.SW2
N$274
  Bottom 1.016: D89.A JB89.1
N$275
  Bottom 0.61: JB89.2 42.54,111.95 42.54,109.54
  Bottom 1.016: S89.SW1 41.28,108.59 42.54,109.54
N$276
  Bottom 1.016: JA89.1 S89.SW2
N$277
  Bottom 1.016: D90.A JB90.1
N$278
  Bottom 1.016: S90.SW1 61.59,109.22 JB90.2
N$279
  Bottom 1.016: JA90.1 S90.SW2
N$280
  Bottom 0.61: JB91.1 D91.A
N$281
  Bottom 1.016: JB91.2 S91.SW1
N$282
  Bottom 1.016: S91.SW2 JA91.1
N$283
  Bottom 1.016: S92.SW1 JB92.2
N$284
  Bottom 1.016: JB92.1 19.68,82.55 25.08,76.2 D92.A
N$285
  Bottom 1.016: JA92.1 S92.SW2
N$286
  Bottom 1.016: JA93.1 S93.SW2
N$287
  Bottom 1.016: JB93.2 36.19,87.95 S93.SW1
N$288
  Bottom 1.016: D93.A 42.54,92.08 42.54,88.9 40,86.68 JB93.1
N$289
  Bottom 1.016: JB94.1 D94.A
N$290
  Bottom 1.016: S94.SW1 JB94.2
N$291
  Bottom 1.016: S94.SW2 JA94.1
N$292
  Bottom 1.016: JB95.1 D95.A
N$293
  Bottom 1.016: JB95.2 S95.SW1
N$294
  Bottom 1.016: JA95.1 S95.SW2
N$295
  Bottom 1.016: JB96.1 21.27,63.69 21.27,61.59 24.97,57.9 D96.A
N$296
  Bottom 1.016: S96.SW1 JB96.2
N$297
  Bottom 1.016: JA96.1 S96.SW2
N$298
  Bottom 1.016: JB97.2 S97.SW1
N$299
  Bottom 1.016: JA97.1 S97.SW2
N$300
  Bottom 1.016: D97.A JB97.1
N$301
  Bottom 0.61: JB98.1 D98.A
N$302
  Bottom 1.016: S98.SW1 JB98.2
N$303
  Bottom 1.016: S98.SW2 JA98.1
N$304
  Bottom 1.016: D99.A 72.58,64.45 JB99.1
N$305
  Bottom 1.016: JB99.2 S99.SW1
N$306
  Bottom 1.016: JA99.1 S99.SW2
N$307
  Bottom 0.406: JB100.1 24.26,49.72 25.08,48.9 26.35,48.9 30.37,44.88 D100.A
N$308
  Bottom 1.016: S100.SW1 JB100.2
N$309
  Bottom 1.016: JA100.1 S100.SW2
N$310
  Bottom 1.016: S101.SW1 JB101.2
N$311
  Bottom 1.016: JB101.1 D101.A
N$312
  Bottom 1.016: S101.SW2 JA101.1
N$313
  Bottom 1.016: JB102.1 56.71,47.5 55.45,46.24 D102.A
N$314
  Bottom 1.016: S102.SW1 JB102.2
N$315
  Bottom 1.016: S102.SW2 JA102.1
N$316
  Bottom 1.016: JB103.1 D103.A
N$317
  Bottom 1.016: JB103.2 73.85,50.99 74.29,51.44 S103.SW1
N$318
  Bottom 1.016: JA103.1 S103.SW2
N$319
  Bottom 0.61: 81.28,20.32 81.28,29.84
  Bottom 1.016: 81.28,29.84 81.28,30.8 81.15,31.24 81.15,32.38 | S107B.SW1 70.48,19.05 71.76,17.78 74.93,17.78 76.2,19.05 80.01,19.05 81.28,20.32 | 81.15,32.38 JB107.2 | S107.SW1 81.15,32.38
N$320
  Bottom 1.016: S104.SW1 JB104.2
N$321
  Bottom 1.016: JA104.1 S104.SW2
N$322
  Bottom 1.016: S105.SW1 JB105.2
N$323
  Bottom 1.016: D105.A JB105.1
N$324
  Bottom 1.016: S105.SW2 JA105.1
N$325
  Bottom 0.61: JB106.1 62.67,34.05 D106.A
N$326
  Bottom 1.016: S106.SW1 JB106.2
N$327
  Bottom 1.016: S106.SW2 JA106.1
N$329
  Bottom 1.016: S108.SW1 JB108.2
N$330
  Bottom 1.016: JA108.1 S108.SW2
N$331
  Bottom 0.406: D108.A 50.17,26.04 49.53,26.67 46.36,28.89 42.23,28.89 38.74,24.77
  Bottom 1.016: 38.74,24.77 30.16,24.77 26.35,19.69 26.35,17.02 JB108.1
N$332
  Bottom 1.016: S109.SW1 38.86,13.33 JB109.2
N$333
  Bottom 1.016: D109.A 47.31,7.3 45.21,9.4 JB109.1
N$334
  Bottom 1.016: JA109.1 S109.SW2
N$335
  Bottom 1.016: JB110.1 D110.A
N$336
  Bottom 0.813: JB110.2 56.07,11.62 S110.SW1
N$337
  Bottom 1.016: JA110.1 S110.SW2
SCK
  Bottom 0.406: JA107.2 64.96,29.53 62.23,29.53 58.74,26.35 | 3D1.15 81.43,120.81 86.04,114.62 86.04,108.59 81.12,103.19 81.12,100.65 81.92,98.9
  Bottom 0.61: 85.09,58.42 81.92,61.59 81.92,64.61 85.09,68.42 | 83.18,28.58 82.55,27.94 82.55,22.86 83.18,21.59 83.18,19.37 | 85.09,74.93 81.6,79.69 81.6,84.14 85.41,88.27 85.41,95.89 81.92,98.9
  Bottom 0.813: D109.C 61.71,7.3 63.29,8.89 D110.C | 83.18,28.58 86.36,31.75 86.36,39.69 81.28,43.18 81.28,45.72
  Bottom 1.016: D110.C 63.29,18.62 62.87,19.05 58.74,24.45 58.74,26.35 | 81.28,45.72 85.09,51.44 85.09,58.42 | 63.29,8.89 64.45,7.62 74.61,7.62 77.47,10.48 77.47,14.6 79.69,16.83 81.6,16.83 83.18,18.41 83.18,19.37 | 85.09,74.93 85.09,68.42

### Text on the board
Bottom: 1 | 9 | 1176-16